# Altium schematic sheet V_2.SchDoc
size A4
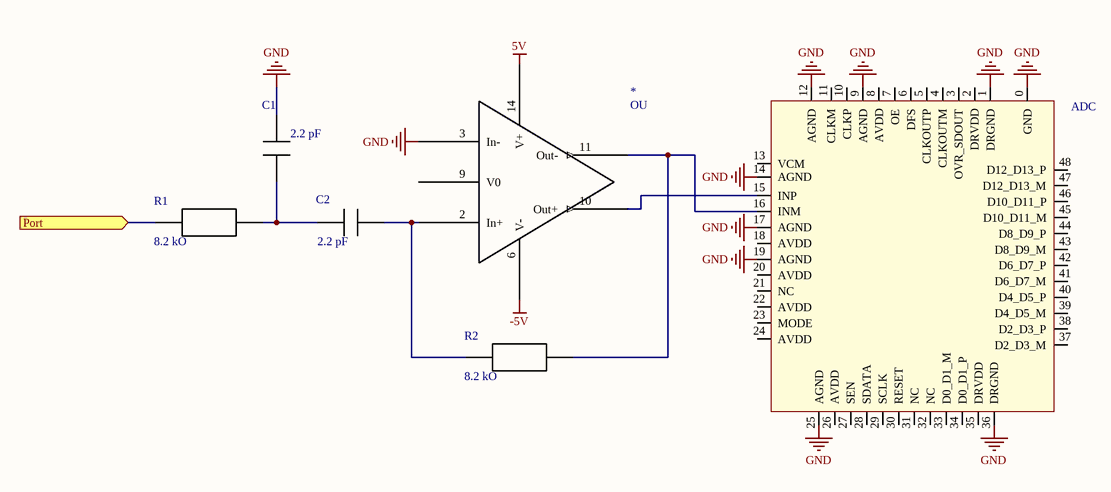
[diagram p0: V_2.SchDoc]

## Parts
*  OU
ADC  (no value)
C1  2.2 pF
C2  2.2 pF
R1  8.2 kO
R2  8.2 kO

## Ports
Port (in)

## Nets
-5V: *.6(V-)
GND: *.3(In-) ADC.0(GND) ADC.1(DRGND) ADC.9(AGND) ADC.12(AGND) ADC.14(AGND) ADC.17(AGND) ADC.19(AGND) ADC.25(AGND) ADC.36(DRGND)
Net*_10: *.10(Out+) ADC.15(INP)
Net*_11: *.11(Out-) ADC.16(INM)

Not connected (* = marked no-connect by the designer): * 2(In+) 9(V0) 14(V+); ADC 2(DRVDD) 3(OVR_SDOUT) 4(CLKOUTM) 5(CLKOUTP) 6(DFS) 7(OE) 8(AVDD) 10(CLKP) 11(CLKM) 13(VCM) 18(AVDD) 20(AVDD) 21(NC) 22(AVDD) 23(MODE) 24(AVDD) 26(AVDD) 27(SEN) 28(SDATA) 29(SCLK) 30(RESET) 31(NC) 32(NC) 33(D0_D1_M) 34(D0_D1_P) 35(DRVDD) 37(D2_D3_M) 38(D2_D3_P) 39(D4_D5_M) 40(D4_D5_P) 41(D6_D7_M) 42(D6_D7_P) 43(D8_D9_M) 44(D8_D9_P) 45(D10_D11_M) 46(D10_D11_P) 47(D12_D13_M) 48(D12_D13_P)

## Notes on the sheet
- Labels drawn without touching a wire or pin: 5V

## Library data of the parts
ADC = ADC
C1 C2 = Condens
R1 R2 = Resist